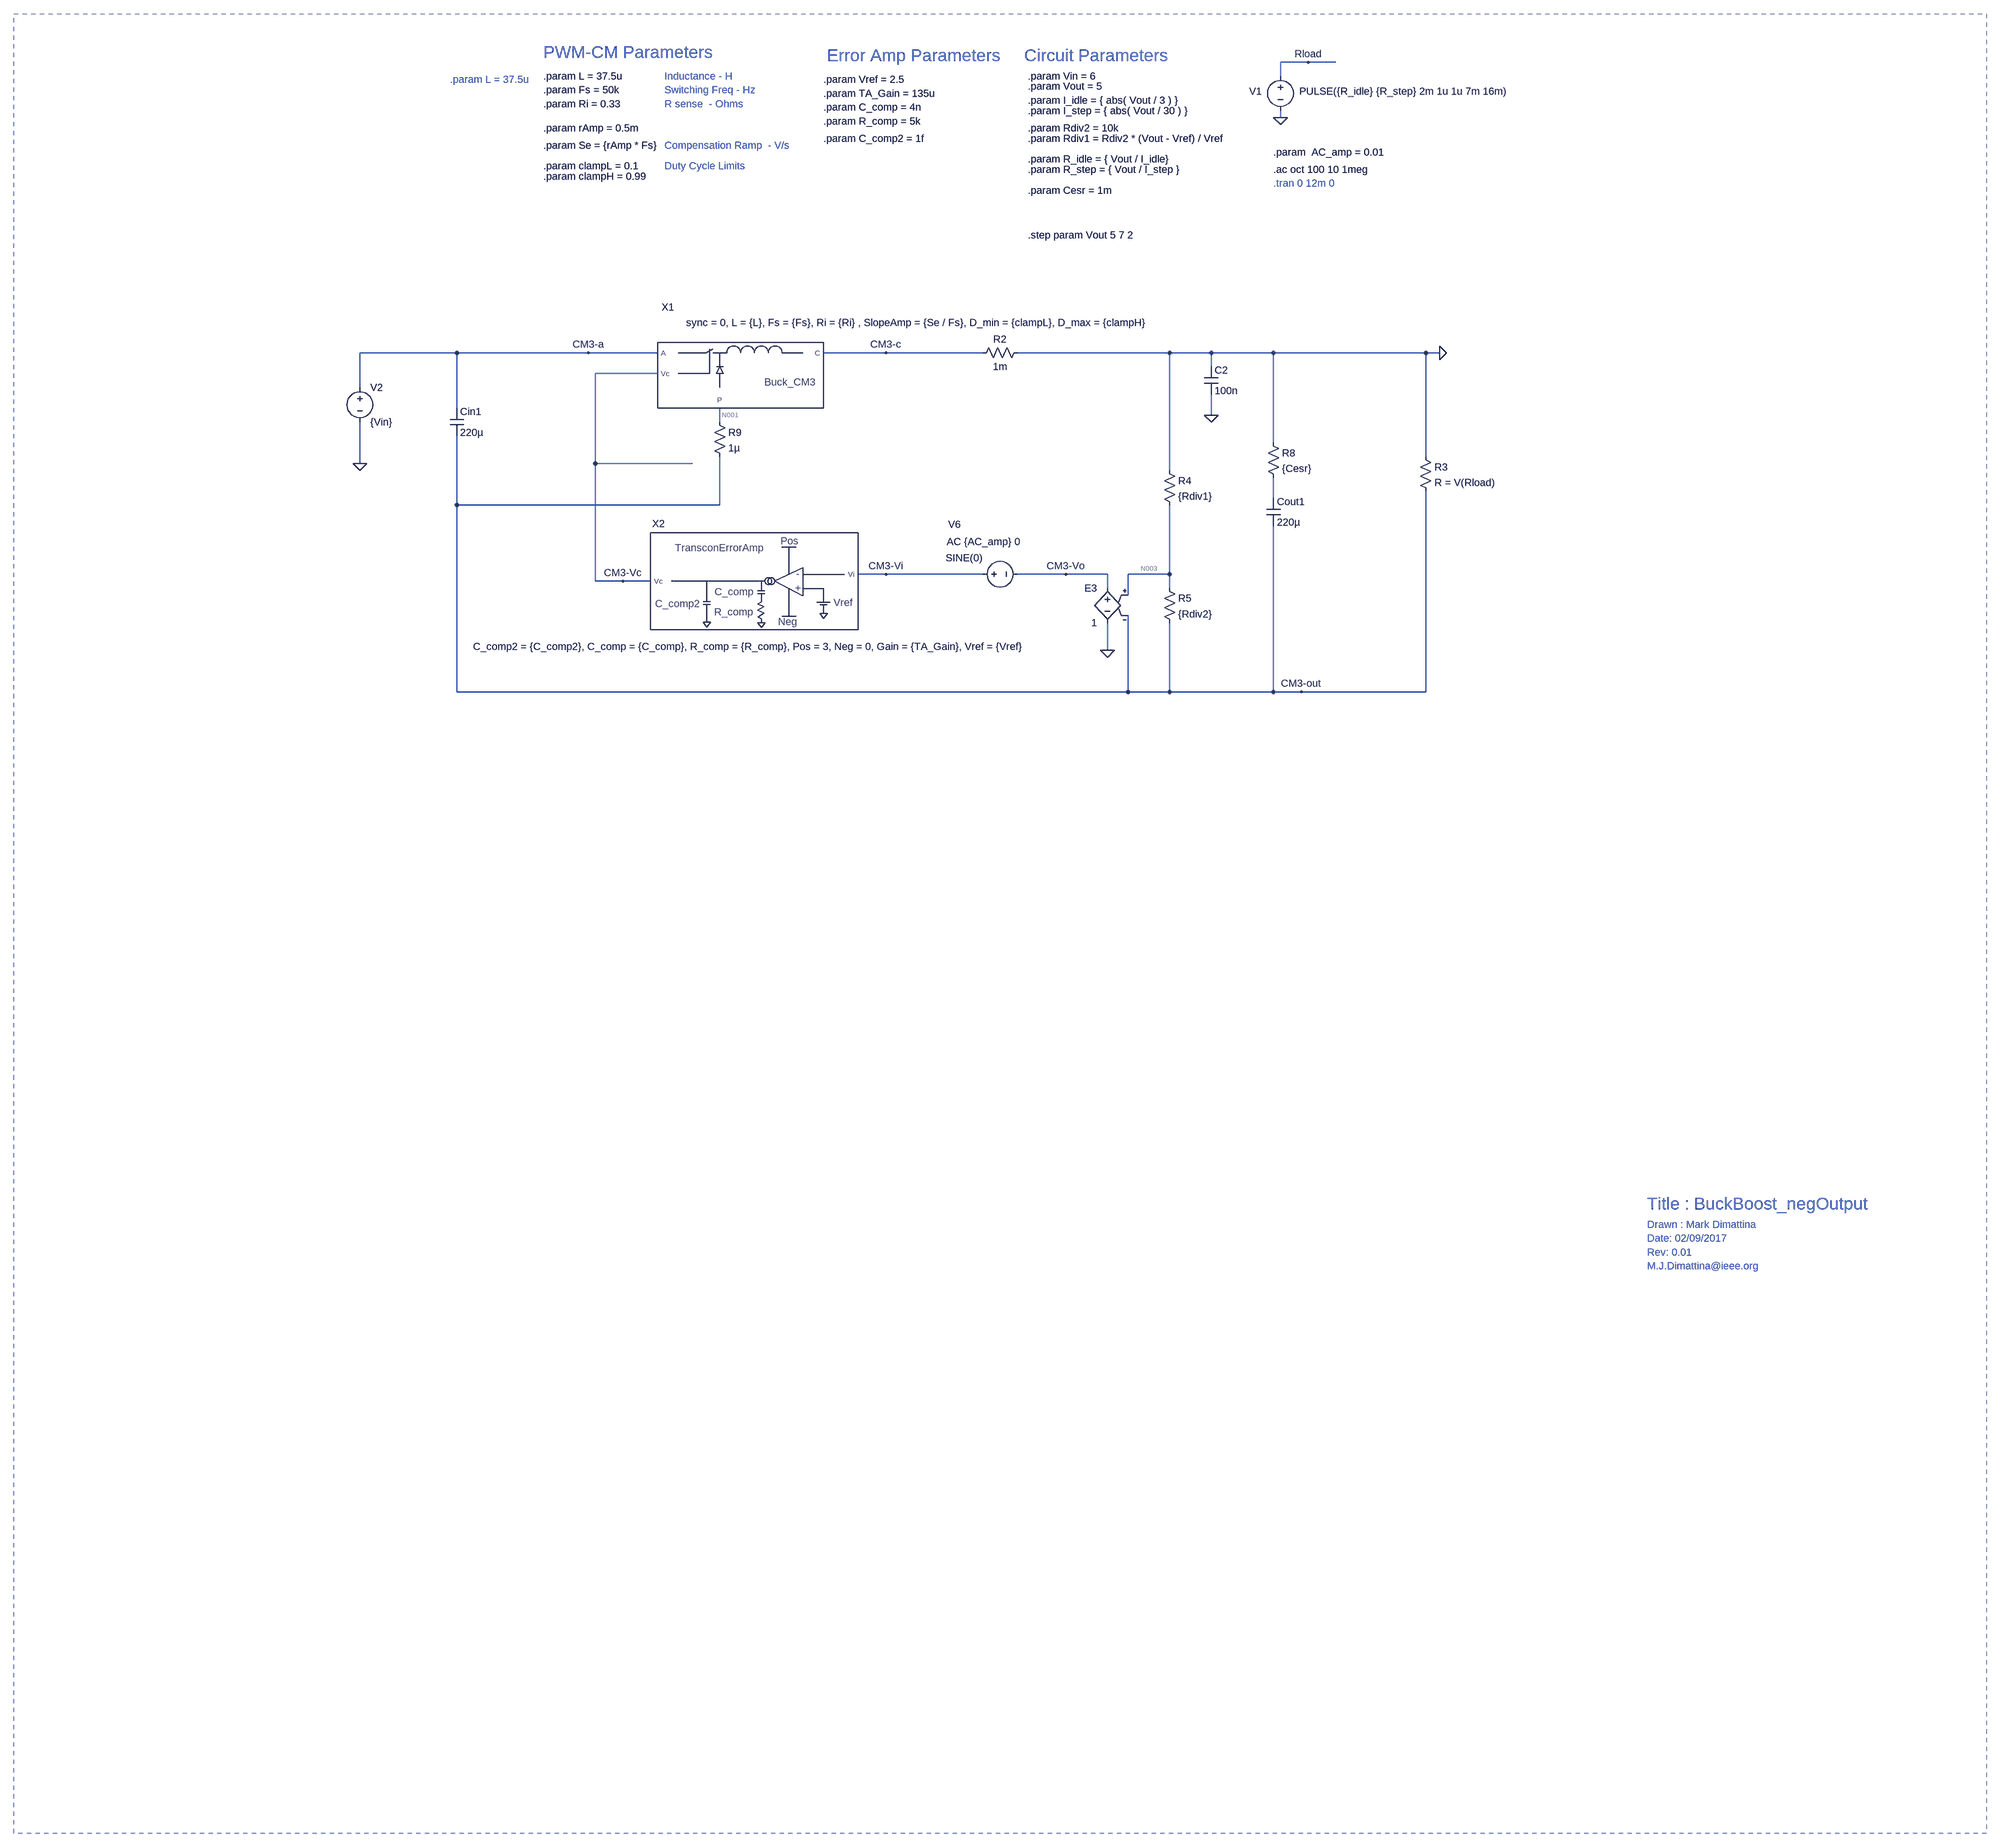
[diagram p0: schematic BuckBoost_negOutput_AC.asc]
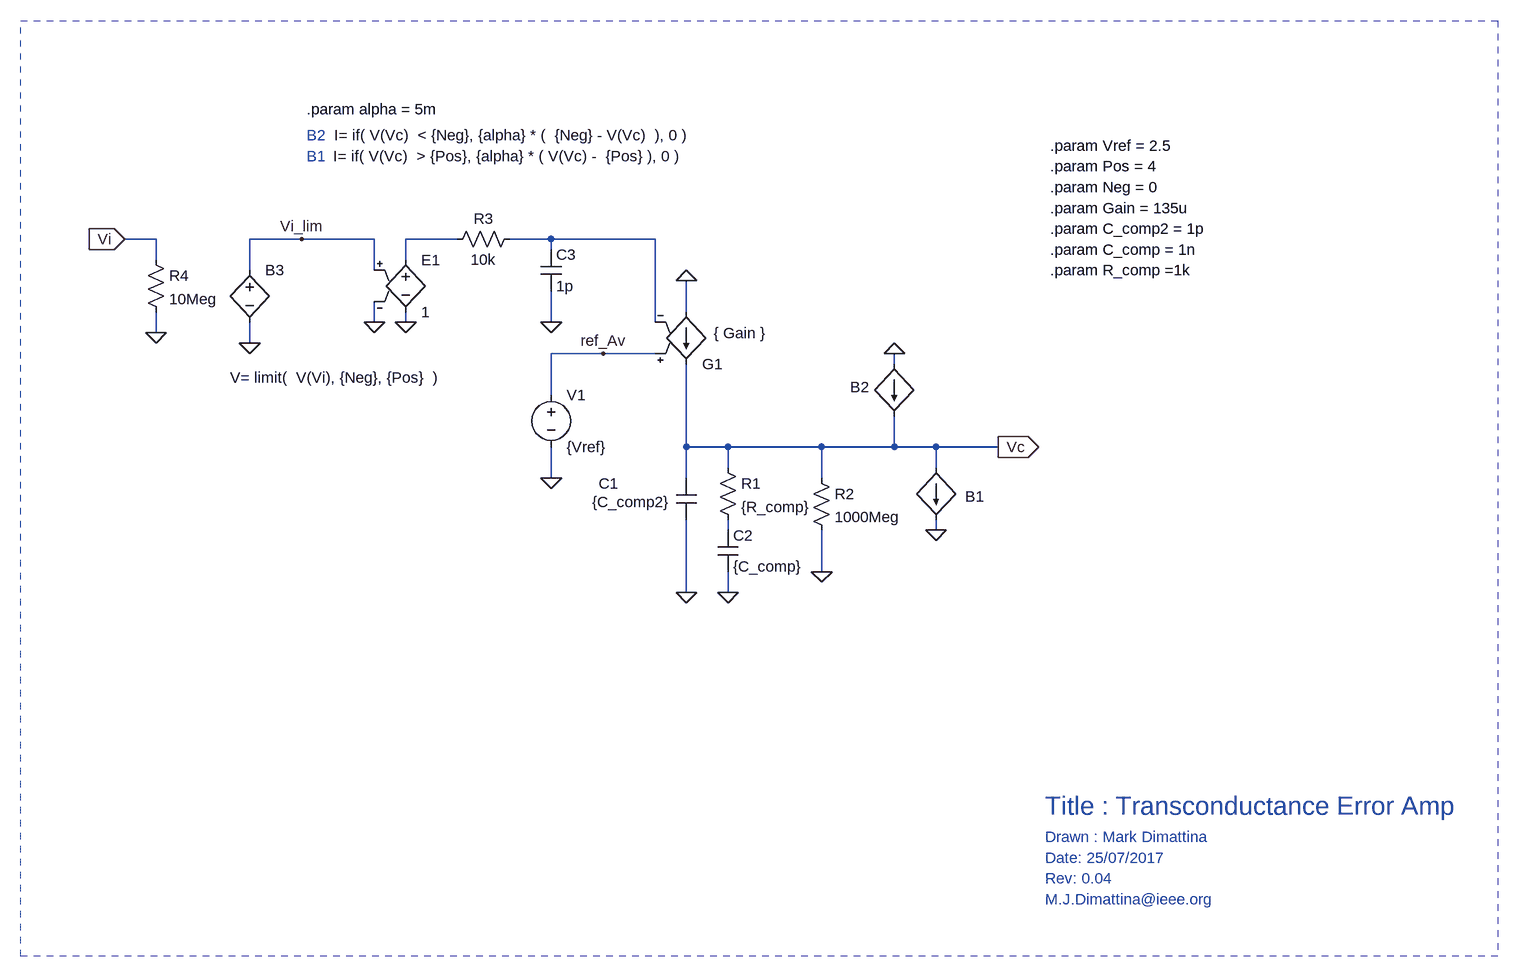
[diagram p1: sub-circuit transconerroramp.asc]
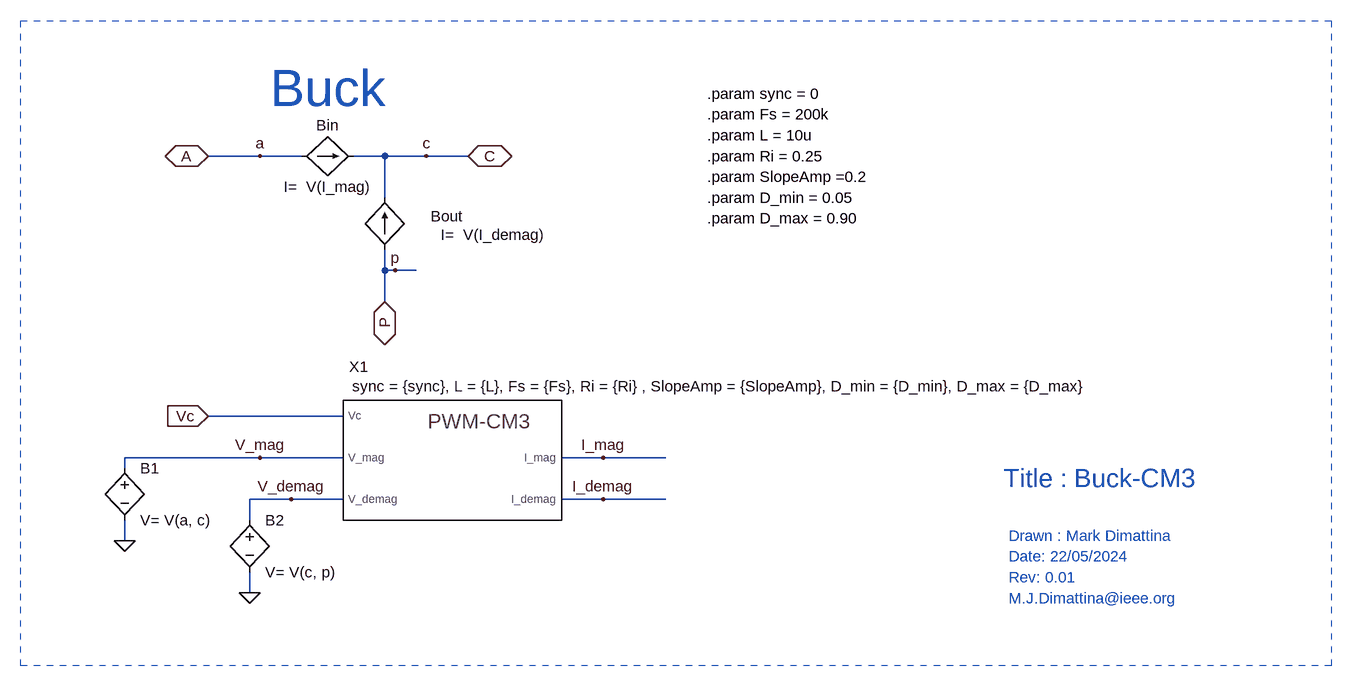
[diagram p2: sub-circuit buck_cm3.asc]
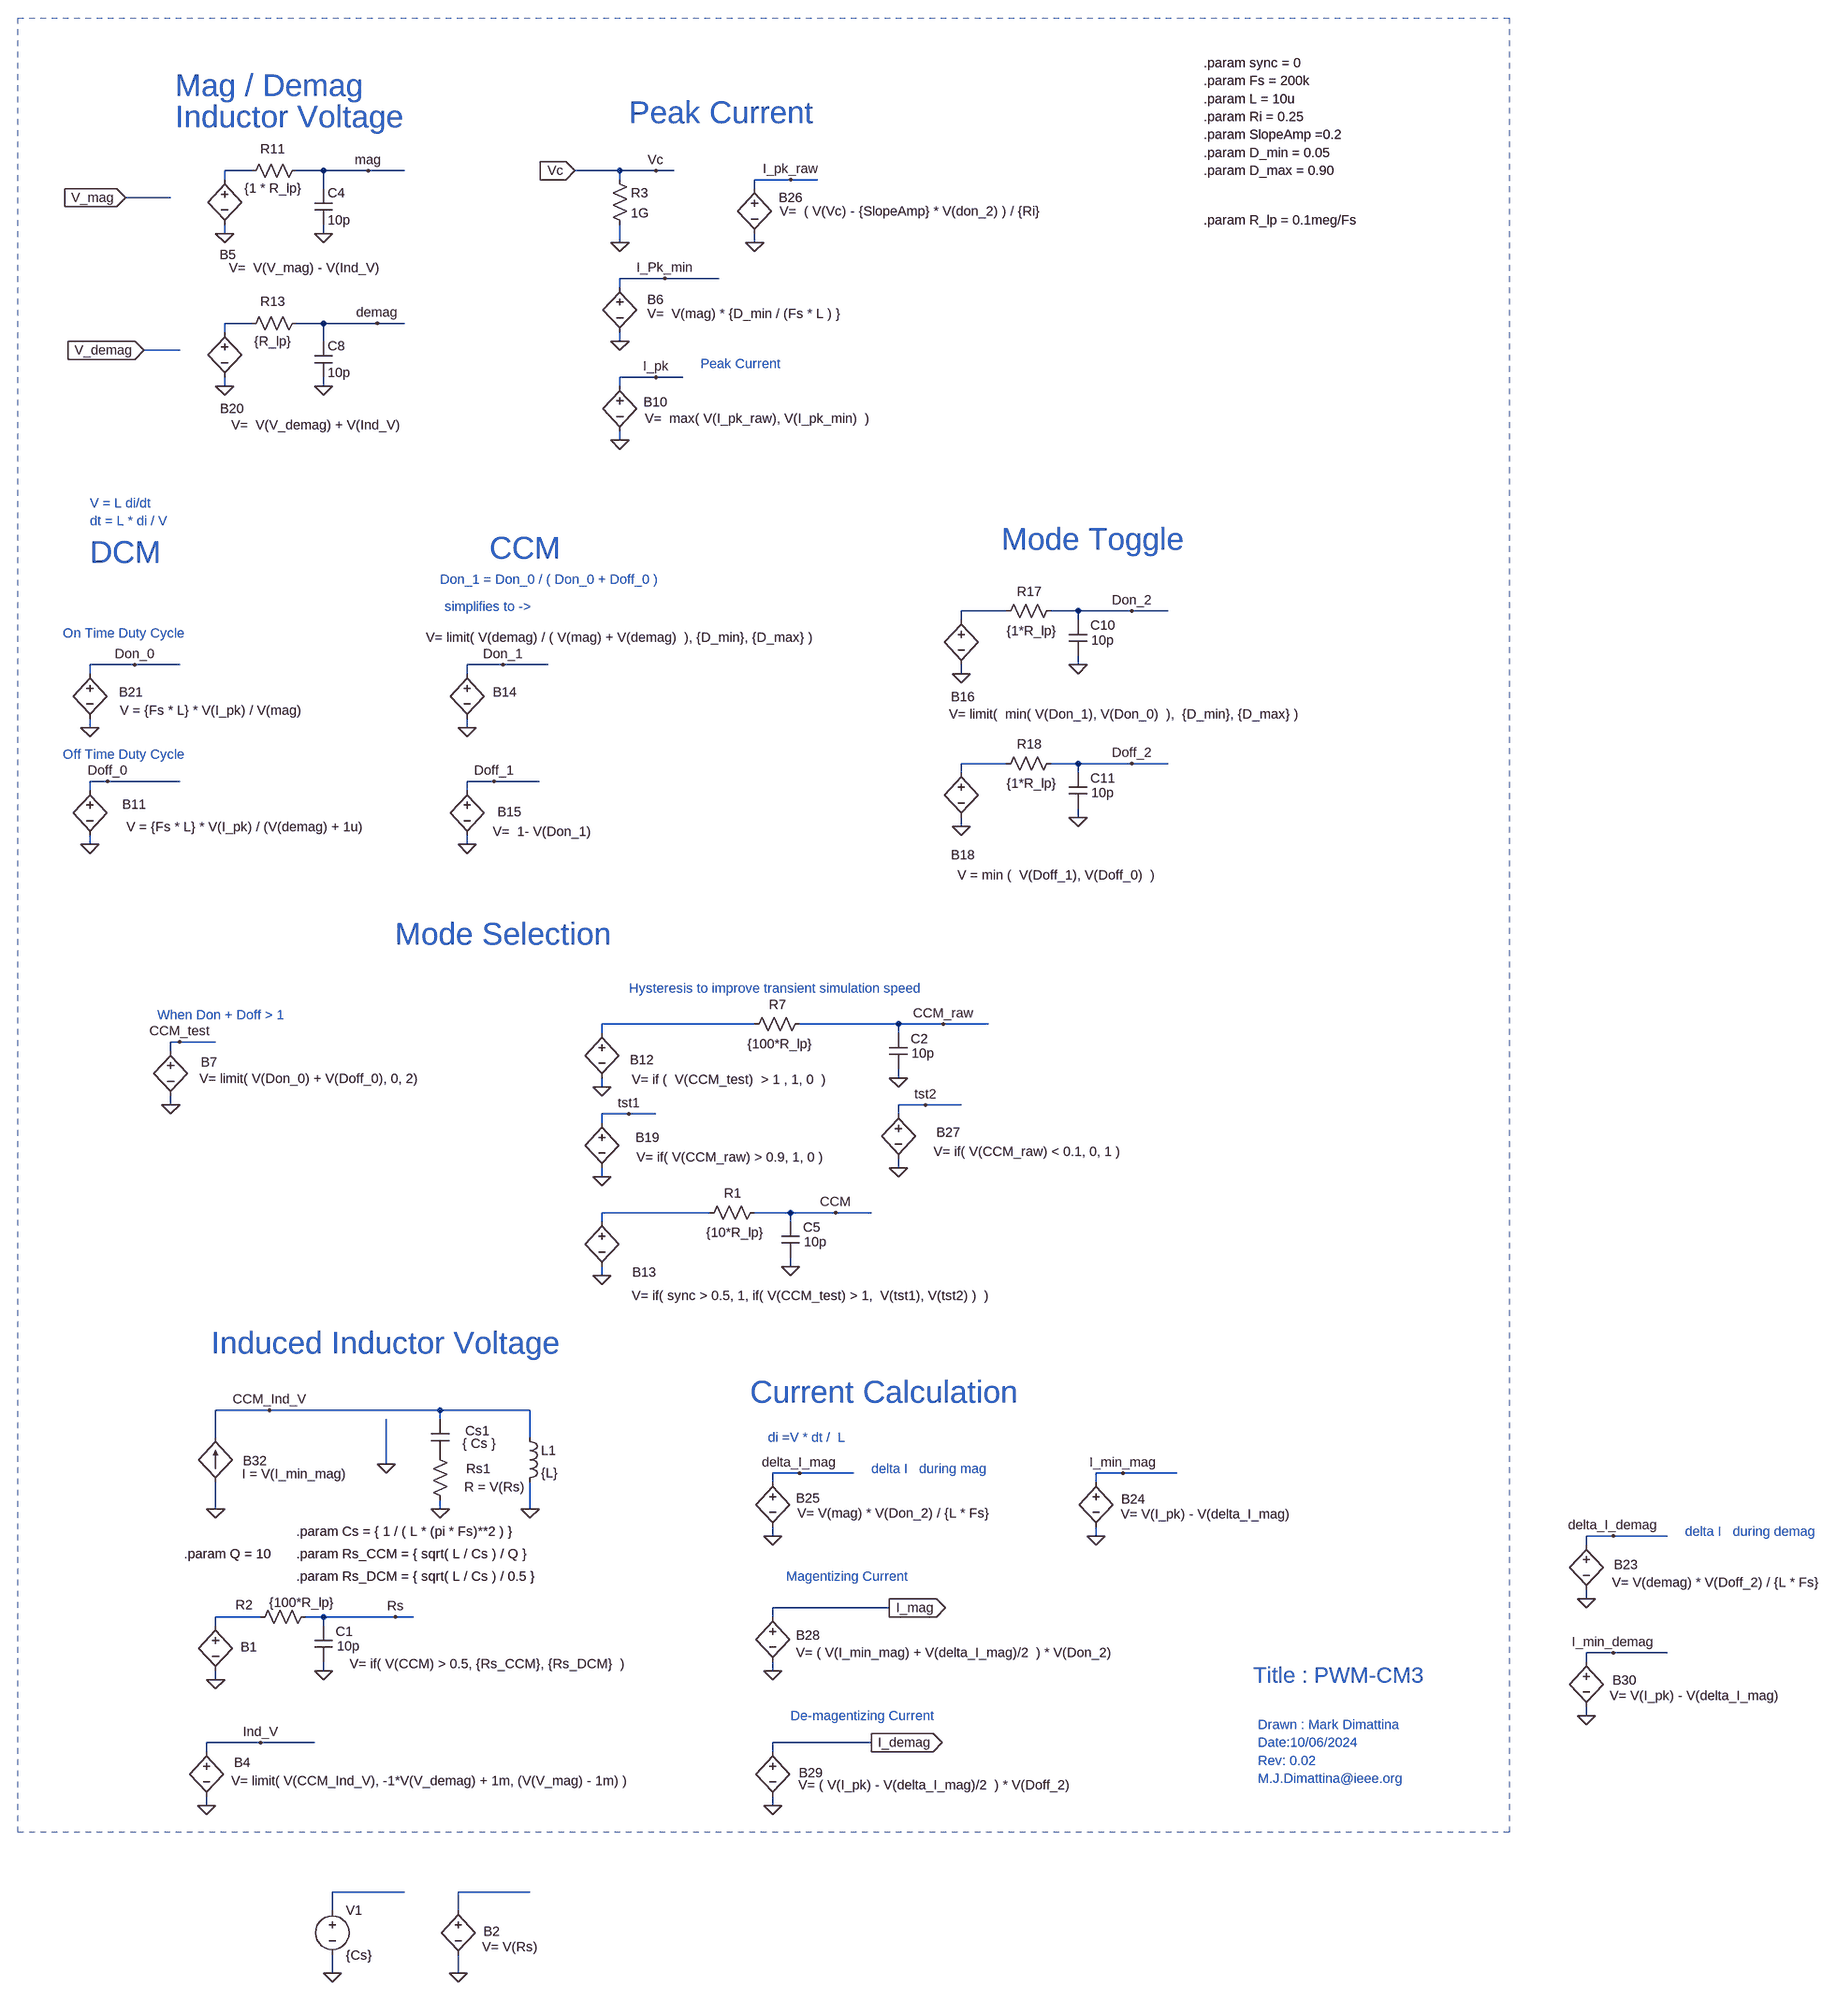
[diagram p3: sub-circuit pwm_cm3.asc]
BuckBoost_negOutput_AC.asc, the LTspice schematic file:
Version 4
SHEET 1 6372 4964
WIRE 2976 864 2912 864
WIRE 3040 864 2976 864
WIRE 2912 896 2912 864
WIRE 2912 992 2912 976
WIRE 1008 1536 784 1536
WIRE 1312 1536 1008 1536
WIRE 1472 1536 1312 1536
WIRE 2000 1536 1856 1536
WIRE 2224 1536 2000 1536
WIRE 2656 1536 2304 1536
WIRE 2752 1536 2656 1536
WIRE 2896 1536 2752 1536
WIRE 3248 1536 2896 1536
WIRE 3280 1536 3248 1536
WIRE 2752 1568 2752 1536
WIRE 1472 1584 1328 1584
WIRE 784 1616 784 1536
WIRE 1008 1664 1008 1536
WIRE 2752 1680 2752 1632
WIRE 1616 1696 1616 1664
WIRE 2896 1744 2896 1536
WIRE 3248 1776 3248 1536
WIRE 784 1792 784 1696
WIRE 1328 1792 1328 1584
WIRE 1552 1792 1328 1792
WIRE 2656 1808 2656 1536
WIRE 2896 1872 2896 1824
WIRE 1008 1888 1008 1728
WIRE 1616 1888 1616 1776
WIRE 1616 1888 1008 1888
WIRE 2000 2048 1936 2048
WIRE 2224 2048 2000 2048
WIRE 2416 2048 2304 2048
WIRE 2512 2048 2416 2048
WIRE 2656 2048 2656 1888
WIRE 2656 2048 2560 2048
WIRE 1328 2064 1328 1792
WIRE 1392 2064 1328 2064
WIRE 1456 2064 1392 2064
WIRE 2512 2080 2512 2048
WIRE 2656 2080 2656 2048
WIRE 2560 2096 2560 2048
WIRE 2512 2224 2512 2160
WIRE 1008 2320 1008 1888
WIRE 2560 2320 2560 2144
WIRE 2560 2320 1008 2320
WIRE 2656 2320 2656 2160
WIRE 2656 2320 2560 2320
WIRE 2896 2320 2896 1936
WIRE 2896 2320 2656 2320
WIRE 2960 2320 2896 2320
WIRE 3248 2320 3248 1856
WIRE 3248 2320 2960 2320
FLAG 2912 992 0
FLAG 2976 864 Rload
FLAG 1312 1536 CM3-a
FLAG 2960 2320 CM3-out
FLAG 784 1792 0
FLAG 1392 2064 CM3-Vc
FLAG 2000 2048 CM3-Vi
FLAG 2752 1680 0
FLAG 2000 1536 CM3-c
FLAG 2512 2224 0
FLAG 3280 1536 0
FLAG 2416 2048 CM3-Vo
DATAFLAG 1472 1792 ""
DATAFLAG 3120 2320 ""
SYMBOL voltage 2912 880 R0
WINDOW 123 0 0 Left 2
WINDOW 39 0 0 Left 2
WINDOW 0 -72 51 Left 2
WINDOW 3 44 51 Left 2
SYMATTR InstName V1
SYMATTR Value PULSE({R_idle} {R_step} 2m 1u 1u 7m 16m)
SYMBOL res 2320 1520 R90
WINDOW 0 0 56 VBottom 2
WINDOW 3 32 56 VTop 2
SYMATTR InstName R2
SYMATTR Value 1m
SYMBOL cap 2880 1872 R0
SYMATTR InstName Cout1
SYMATTR Value 220µ
SYMBOL res 3232 1760 R0
SYMATTR InstName R3
SYMATTR Value R = V(Rload)
SYMBOL res 2640 1792 R0
SYMATTR InstName R4
SYMATTR Value {Rdiv1}
SYMBOL res 2640 2064 R0
SYMATTR InstName R5
SYMATTR Value {Rdiv2}
SYMBOL voltage 784 1600 R0
SYMATTR InstName V2
SYMATTR Value {Vin}
SYMBOL res 2880 1728 R0
SYMATTR InstName R8
SYMATTR Value {Cesr}
SYMBOL res 1600 1680 R0
SYMATTR InstName R9
SYMATTR Value 1µ
SYMBOL TransconErrorAmp 1840 1984 M0
WINDOW 0 380 -53 Right 2
WINDOW 39 794 231 Right 2
SYMATTR InstName X2
SYMATTR SpiceLine C_comp2 = {C_comp2}, C_comp = {C_comp}, R_comp = {R_comp}, Pos = 3, Neg = 0, Gain = {TA_Gain}, Vref = {Vref}
SYMBOL voltage 2208 2048 R270
WINDOW 0 115 -64 VRight 2
WINDOW 3 38 -70 VRight 2
WINDOW 123 75 -67 VRight 2
WINDOW 39 0 0 Left 2
SYMATTR InstName V6
SYMATTR Value SINE(0)
SYMATTR Value2 AC {AC_amp} 0
SYMBOL cap 2736 1568 R0
SYMATTR InstName C2
SYMATTR Value 100n
SYMBOL e 2512 2064 M0
SYMATTR InstName E3
SYMATTR Value 1
SYMBOL cap 992 1664 R0
SYMATTR InstName Cin1
SYMATTR Value 220µ
SYMBOL Buck_CM3 1552 1568 R0
WINDOW 0 -56 -122 Bottom 2
WINDOW 39 518 -86 Bottom 2
SYMATTR InstName X1
SYMATTR SpiceLine sync = 0, L = {L}, Fs = {Fs}, Ri = {Ri} , SlopeAmp = {Se / Fs}, D_min = {clampL}, D_max = {clampH}
TEXT 1208 1104 Left 2 !.param clampL = 0.1
TEXT 1208 1128 Left 2 !.param clampH = 0.99
TEXT 2896 1112 Left 2 !.ac oct 100 10 1meg
TEXT 1208 896 Left 2 !.param L = 37.5u
TEXT 1208 928 Left 2 !.param Fs = 50k
TEXT 1208 960 Left 2 !.param Ri = 0.33
TEXT 1208 1056 Left 2 !.param Se = {rAmp * Fs}
TEXT 1488 1056 Left 2 ;Compensation Ramp  - V/s
TEXT 1488 960 Left 2 ;R sense  - Ohms
TEXT 1488 928 Left 2 ;Switching Freq - Hz
TEXT 1488 896 Left 2 ;Inductance - H
TEXT 1488 1104 Left 2 ;Duty Cycle Limits
TEXT 1208 840 Left 4 ;PWM-CM Parameters
TEXT 1856 904 Left 2 !.param Vref = 2.5
TEXT 1856 936 Left 2 !.param TA_Gain = 135u
TEXT 1856 968 Left 2 !.param C_comp = 4n
TEXT 1856 1000 Left 2 !.param R_comp = 5k
TEXT 2328 952 Left 2 !.param I_idle = { abs( Vout / 3 ) }
TEXT 2328 976 Left 2 !.param I_step = { abs( Vout / 30 ) }
TEXT 2328 920 Left 2 !.param Vout = 5
TEXT 2328 1088 Left 2 !.param R_idle = { Vout / I_idle}
TEXT 2328 1112 Left 2 !.param R_step = { Vout / I_step }
TEXT 2328 896 Left 2 !.param Vin = 6
TEXT 2328 1016 Left 2 !.param Rdiv2 = 10k
TEXT 2328 1040 Left 2 !.param Rdiv1 = Rdiv2 * (Vout - Vref) / Vref
TEXT 1208 1016 Left 2 !.param rAmp = 0.5m
TEXT 1864 848 Left 4 ;Error Amp Parameters
TEXT 2320 848 Left 4 ;Circuit Parameters
TEXT 3760 3552 Left 2 ;Drawn : Mark Dimattina
TEXT 3760 3504 Left 4 ;Title : BuckBoost_negOutput
TEXT 3760 3616 Left 2 ;Rev: 0.01
TEXT 3760 3584 Left 2 ;Date: 02/09/2017
TEXT 3760 3648 Left 2 ;M.J.Dimattina@ieee.org
TEXT 2328 1264 Left 2 !.step param Vout 5 7 2
TEXT 2896 1072 Left 2 !.param  AC_amp = 0.01
TEXT 992 904 Left 2 ;.param L = 37.5u
TEXT 2896 1144 Left 2 ;.tran 0 12m 0
TEXT 2328 1160 Left 2 !.param Cesr = 1m
TEXT 1856 1040 Left 2 !.param C_comp2 = 1f
RECTANGLE Normal 4544 4960 -16 752 2

transconerroramp.asc, the sub-circuit schematic file:
Version 4
SHEET 1 1752 1300
WIRE -560 192 -608 192
WIRE -336 192 -416 192
WIRE -224 192 -336 192
WIRE -96 192 -176 192
WIRE 48 192 -16 192
WIRE 208 192 48 192
WIRE 48 208 48 192
WIRE -560 224 -560 192
WIRE -176 224 -176 192
WIRE -416 240 -416 192
WIRE -224 240 -224 192
WIRE 256 304 256 256
WIRE -224 320 -224 288
WIRE -176 320 -176 304
WIRE 48 320 48 272
WIRE 208 320 208 192
WIRE -560 336 -560 304
WIRE -416 352 -416 320
WIRE 128 368 48 368
WIRE 208 368 128 368
WIRE 576 384 576 368
WIRE 48 432 48 368
WIRE 256 512 256 384
WIRE 320 512 256 512
WIRE 464 512 320 512
WIRE 576 512 576 464
WIRE 576 512 464 512
WIRE 640 512 576 512
WIRE 736 512 640 512
WIRE 320 544 320 512
WIRE 640 544 640 512
WIRE 48 560 48 512
WIRE 256 560 256 512
WIRE 464 560 464 512
WIRE 320 640 320 624
WIRE 640 640 640 624
WIRE 464 704 464 640
WIRE 256 736 256 624
WIRE 320 736 320 704
FLAG 48 560 0
FLAG 256 256 0
FLAG 256 736 0
FLAG 320 736 0
FLAG 128 368 ref_Av
FLAG -608 192 Vi
IOPIN -608 192 In
FLAG 736 512 Vc
IOPIN 736 512 Out
FLAG 640 640 0
FLAG 576 368 0
FLAG 464 704 0
FLAG -176 320 0
FLAG -224 320 0
FLAG 48 320 0
FLAG -416 352 0
FLAG -336 192 Vi_lim
FLAG -560 336 0
SYMBOL g 256 400 M180
WINDOW 3 42 63 Left 2
SYMATTR Value { Gain }
SYMATTR InstName G1
SYMBOL voltage 48 416 R0
SYMATTR InstName V1
SYMATTR Value {Vref}
SYMBOL cap 240 560 R0
WINDOW 3 -129 37 Left 2
WINDOW 0 -119 8 Left 2
SYMATTR Value {C_comp2}
SYMATTR InstName C1
SYMBOL cap 304 640 R0
SYMATTR InstName C2
SYMATTR Value {C_comp}
SYMBOL res 304 528 R0
SYMATTR InstName R1
SYMATTR Value {R_comp}
SYMBOL bi 640 544 R0
WINDOW 3 -927 -480 Left 2
WINDOW 0 45 44 Left 2
SYMATTR Value I= if( V(Vc)  > {Pos}, {alpha} * ( V(Vc) -  {Pos} ), 0 )
SYMATTR InstName B1
SYMBOL bi 576 384 R0
WINDOW 0 -68 36 Left 2
WINDOW 3 -862 -352 Left 2
SYMATTR InstName B2
SYMATTR Value I= if( V(Vc)  < {Neg}, {alpha} * (  {Neg} - V(Vc)  ), 0 )
SYMBOL res 448 544 R0
SYMATTR InstName R2
SYMATTR Value 1000Meg
SYMBOL cap 32 208 R0
SYMATTR InstName C3
SYMATTR Value 1p
SYMBOL res 0 176 R90
WINDOW 0 0 56 VBottom 2
WINDOW 3 32 56 VTop 2
SYMATTR InstName R3
SYMATTR Value 10k
SYMBOL e -176 208 R0
SYMATTR InstName E1
SYMATTR Value 1
SYMBOL bv -416 224 R0
WINDOW 3 -30 181 Left 2
SYMATTR Value V= limit(  V(Vi), {Neg}, {Pos}  )
SYMATTR InstName B3
SYMBOL res -576 208 R0
SYMATTR InstName R4
SYMATTR Value 10Meg
TEXT -328 -8 Left 2 !.param alpha = 5m
TEXT 816 240 Left 2 !.param R_comp =1k
TEXT 816 208 Left 2 !.param C_comp = 1n
TEXT 816 176 Left 2 !.param C_comp2 = 1p
TEXT -328 64 Left 2 ;B1
TEXT -328 32 Left 2 ;B2
TEXT 808 1112 Left 2 ;Drawn : Mark Dimattina
TEXT 808 1064 Left 4 ;Title : Transconductance Error Amp
TEXT 808 1176 Left 2 ;Rev: 0.04
TEXT 808 1144 Left 2 ;Date: 25/07/2017
TEXT 808 1208 Left 2 ;M.J.Dimattina@ieee.org
TEXT 816 80 Left 2 !.param Pos = 4
TEXT 816 112 Left 2 !.param Neg = 0
TEXT 816 48 Left 2 !.param Vref = 2.5
TEXT 816 144 Left 2 !.param Gain = 135u
RECTANGLE Normal 1504 1296 -768 -144 2

buck_cm3.asc, the sub-circuit schematic file:
Version 4
SHEET 1 3748 852
WIRE -1872 -2512 -1952 -2512
WIRE -1808 -2512 -1872 -2512
WIRE -1680 -2512 -1728 -2512
WIRE -1616 -2512 -1680 -2512
WIRE -1552 -2512 -1616 -2512
WIRE -1680 -2448 -1680 -2512
WIRE -1680 -2336 -1680 -2368
WIRE -1664 -2336 -1680 -2336
WIRE -1632 -2336 -1664 -2336
WIRE -1680 -2288 -1680 -2336
WIRE -1744 -2112 -1952 -2112
WIRE -1872 -2048 -2080 -2048
WIRE -1744 -2048 -1872 -2048
WIRE -1344 -2048 -1408 -2048
WIRE -1248 -2048 -1344 -2048
WIRE -2080 -2032 -2080 -2048
WIRE -1824 -1984 -1888 -1984
WIRE -1744 -1984 -1824 -1984
WIRE -1344 -1984 -1408 -1984
WIRE -1248 -1984 -1344 -1984
WIRE -1888 -1952 -1888 -1984
WIRE -2080 -1920 -2080 -1952
WIRE -1888 -1840 -1888 -1872
FLAG -1952 -2512 A
IOPIN -1952 -2512 BiDir
FLAG -1664 -2336 p
FLAG -1552 -2512 C
IOPIN -1552 -2512 BiDir
FLAG -1680 -2288 P
IOPIN -1680 -2288 BiDir
FLAG -1616 -2512 c
FLAG -1872 -2512 a
FLAG -1952 -2112 Vc
IOPIN -1952 -2112 In
FLAG -2080 -1920 0
FLAG -1888 -1840 0
FLAG -1344 -2048 I_mag
FLAG -1344 -1984 I_demag
FLAG -1872 -2048 V_mag
FLAG -1824 -1984 V_demag
SYMBOL bi -1808 -2512 R270
WINDOW 0 32 40 VTop 2
WINDOW 3 -32 40 VBottom 2
SYMATTR InstName Bin
SYMATTR Value I=  V(I_mag)
SYMBOL bi -1680 -2368 R180
WINDOW 0 -120 51 Left 2
WINDOW 3 -247 23 Left 2
SYMATTR InstName Bout
SYMATTR Value I=  V(I_demag)
SYMBOL PWM_CM3 -1584 -2048 R0
WINDOW 0 -136 -124 Bottom 2
WINDOW 39 -146 -110 Left 2
SYMATTR InstName X1
SYMATTR SpiceLine sync = {sync}, L = {L}, Fs = {Fs}, Ri = {Ri} , SlopeAmp = {SlopeAmp}, D_min = {D_min}, D_max = {D_max}
SYMBOL bv -2080 -2048 R0
SYMATTR InstName B1
SYMATTR Value V= V(a, c)
SYMBOL bv -1888 -1968 R0
SYMATTR InstName B2
SYMATTR Value V= V(c, p)
TEXT -1184 -2544 Left 2 !.param L = 10u
TEXT -1184 -2576 Left 2 !.param Fs = 200k
TEXT -1184 -2448 Left 2 !.param D_min = 0.05
TEXT -1184 -2416 Left 2 !.param D_max = 0.90
TEXT -1184 -2480 Left 2 !.param SlopeAmp =0.2
TEXT -1184 -2512 Left 2 !.param Ri = 0.25
TEXT -1184 -2608 Left 2 !.param sync = 0
TEXT -720 -1928 Left 2 ;Drawn : Mark Dimattina
TEXT -728 -2016 Left 4 ;Title : Buck-CM3
TEXT -720 -1864 Left 2 ;Rev: 0.01
TEXT -720 -1896 Left 2 ;Date: 22/05/2024
TEXT -720 -1832 Left 2 ;M.J.Dimattina@ieee.org
TEXT -1856 -2616 Left 6 ;Buck
RECTANGLE Normal -224 -1728 -2240 -2720 2

pwm_cm3.asc, the sub-circuit schematic file:
Version 4
SHEET 1 4220 852
WIRE -1600 -4432 -1648 -4432
WIRE -1472 -4432 -1520 -4432
WIRE -1392 -4432 -1472 -4432
WIRE -1328 -4432 -1392 -4432
WIRE -944 -4432 -1024 -4432
WIRE -880 -4432 -944 -4432
WIRE -848 -4432 -880 -4432
WIRE -1648 -4416 -1648 -4432
WIRE -944 -4416 -944 -4432
WIRE -640 -4416 -704 -4416
WIRE -592 -4416 -640 -4416
WIRE -1472 -4400 -1472 -4432
WIRE -704 -4400 -704 -4416
WIRE -1744 -4384 -1824 -4384
WIRE -1648 -4320 -1648 -4336
WIRE -1472 -4320 -1472 -4336
WIRE -944 -4304 -944 -4336
WIRE -704 -4304 -704 -4320
WIRE -864 -4240 -944 -4240
WIRE -768 -4240 -864 -4240
WIRE -944 -4224 -944 -4240
WIRE -1600 -4160 -1648 -4160
WIRE -1472 -4160 -1520 -4160
WIRE -1376 -4160 -1472 -4160
WIRE -1328 -4160 -1376 -4160
WIRE -1648 -4144 -1648 -4160
WIRE -1472 -4128 -1472 -4160
WIRE -944 -4128 -944 -4144
WIRE -1728 -4112 -1792 -4112
WIRE -880 -4064 -944 -4064
WIRE -832 -4064 -880 -4064
WIRE -1648 -4048 -1648 -4064
WIRE -1472 -4048 -1472 -4064
WIRE -944 -4048 -944 -4064
WIRE -944 -3952 -944 -3968
WIRE -256 -3648 -336 -3648
WIRE -128 -3648 -176 -3648
WIRE -32 -3648 -128 -3648
WIRE 32 -3648 -32 -3648
WIRE -336 -3632 -336 -3648
WIRE -128 -3632 -128 -3648
WIRE -1808 -3552 -1888 -3552
WIRE -1728 -3552 -1808 -3552
WIRE -1152 -3552 -1216 -3552
WIRE -1072 -3552 -1152 -3552
WIRE -128 -3552 -128 -3568
WIRE -1888 -3536 -1888 -3552
WIRE -1216 -3536 -1216 -3552
WIRE -336 -3536 -336 -3552
WIRE -1888 -3440 -1888 -3456
WIRE -1216 -3440 -1216 -3456
WIRE -256 -3376 -336 -3376
WIRE -128 -3376 -176 -3376
WIRE -32 -3376 -128 -3376
WIRE 32 -3376 -32 -3376
WIRE -336 -3360 -336 -3376
WIRE -128 -3360 -128 -3376
WIRE -1856 -3344 -1888 -3344
WIRE -1728 -3344 -1856 -3344
WIRE -1168 -3344 -1216 -3344
WIRE -1088 -3344 -1168 -3344
WIRE -1888 -3328 -1888 -3344
WIRE -1216 -3328 -1216 -3344
WIRE -128 -3280 -128 -3296
WIRE -336 -3264 -336 -3280
WIRE -1888 -3232 -1888 -3248
WIRE -1216 -3232 -1216 -3248
WIRE -704 -2912 -976 -2912
WIRE -448 -2912 -624 -2912
WIRE -368 -2912 -448 -2912
WIRE -288 -2912 -368 -2912
WIRE -976 -2896 -976 -2912
WIRE -448 -2896 -448 -2912
WIRE -1728 -2880 -1744 -2880
WIRE -1664 -2880 -1728 -2880
WIRE -1744 -2864 -1744 -2880
WIRE -448 -2816 -448 -2832
WIRE -976 -2800 -976 -2816
WIRE -1744 -2768 -1744 -2784
WIRE -400 -2768 -448 -2768
WIRE -336 -2768 -400 -2768
WIRE -928 -2752 -976 -2752
WIRE -880 -2752 -928 -2752
WIRE -448 -2752 -448 -2768
WIRE -976 -2736 -976 -2752
WIRE -448 -2656 -448 -2672
WIRE -976 -2640 -976 -2656
WIRE -784 -2576 -976 -2576
WIRE -640 -2576 -704 -2576
WIRE -560 -2576 -640 -2576
WIRE -496 -2576 -560 -2576
WIRE -976 -2560 -976 -2576
WIRE -640 -2560 -640 -2576
WIRE -640 -2480 -640 -2496
WIRE -976 -2464 -976 -2480
WIRE -1568 -2224 -1664 -2224
WIRE -1264 -2224 -1568 -2224
WIRE -1104 -2224 -1264 -2224
WIRE -1264 -2208 -1264 -2224
WIRE -1664 -2176 -1664 -2224
WIRE -1104 -2176 -1104 -2224
WIRE -1360 -2128 -1360 -2208
WIRE -624 -2112 -672 -2112
WIRE -528 -2112 -624 -2112
WIRE -48 -2112 -96 -2112
WIRE 48 -2112 -48 -2112
WIRE -672 -2096 -672 -2112
WIRE -96 -2096 -96 -2112
WIRE -1664 -2048 -1664 -2096
WIRE -1264 -2048 -1264 -2064
WIRE -1104 -2048 -1104 -2096
WIRE -672 -2000 -672 -2016
WIRE -96 -2000 -96 -2016
WIRE 832 -2000 784 -2000
WIRE 928 -2000 832 -2000
WIRE 784 -1984 784 -2000
WIRE 784 -1888 784 -1904
WIRE -464 -1872 -672 -1872
WIRE -1584 -1856 -1664 -1856
WIRE -1472 -1856 -1504 -1856
WIRE -1344 -1856 -1472 -1856
WIRE -1312 -1856 -1344 -1856
WIRE -672 -1856 -672 -1872
WIRE -1664 -1840 -1664 -1856
WIRE -1472 -1840 -1472 -1856
WIRE 832 -1792 784 -1792
WIRE 928 -1792 832 -1792
WIRE 784 -1776 784 -1792
WIRE -1472 -1760 -1472 -1776
WIRE -672 -1760 -672 -1776
WIRE -1664 -1744 -1664 -1760
WIRE 784 -1680 784 -1696
WIRE -1584 -1632 -1680 -1632
WIRE -1488 -1632 -1584 -1632
WIRE -496 -1632 -672 -1632
WIRE -1680 -1616 -1680 -1632
WIRE -672 -1616 -672 -1632
WIRE -1680 -1520 -1680 -1536
WIRE -672 -1520 -672 -1536
WIRE -1328 -1312 -1456 -1312
WIRE -1104 -1312 -1232 -1312
WIRE -1456 -1280 -1456 -1312
WIRE -1232 -1280 -1232 -1312
WIRE -1456 -1168 -1456 -1200
WIRE -1232 -1168 -1232 -1200
FLAG -944 -4304 0
FLAG -1024 -4432 Vc
IOPIN -1024 -4432 In
FLAG -880 -4432 Vc
FLAG -880 -4064 I_pk
FLAG -944 -4128 0
FLAG -864 -4240 I_Pk_min
FLAG -944 -3952 0
FLAG -704 -4304 0
FLAG -640 -4416 I_pk_raw
FLAG -1888 -3440 0
FLAG -1808 -3552 Don_0
FLAG -1888 -3232 0
FLAG -976 -2800 0
FLAG -560 -2576 CCM
FLAG -448 -2816 0
FLAG -1216 -3440 0
FLAG -1216 -3232 0
FLAG -1168 -3344 Doff_1
FLAG -336 -3536 0
FLAG -32 -3648 Don_2
FLAG -128 -3552 0
FLAG -336 -3264 0
FLAG -32 -3376 Doff_2
FLAG -128 -3280 0
FLAG 784 -1888 0
FLAG 832 -2000 delta_I_demag
FLAG -96 -2000 0
FLAG -48 -2112 I_min_mag
FLAG -672 -2000 0
FLAG -624 -2112 delta_I_mag
FLAG -672 -1760 0
FLAG -464 -1872 I_mag
IOPIN -464 -1872 Out
FLAG -672 -1520 0
FLAG -496 -1632 I_demag
IOPIN -496 -1632 Out
FLAG 784 -1680 0
FLAG 832 -1792 I_min_demag
FLAG -1856 -3344 Doff_0
FLAG -1568 -2224 CCM_Ind_V
FLAG -1648 -4320 0
FLAG -1392 -4432 mag
FLAG -1472 -4320 0
FLAG -1456 -1168 0
FLAG -368 -2912 CCM_raw
FLAG -1152 -3552 Don_1
FLAG -1680 -1520 0
FLAG -1584 -1632 Ind_V
FLAG -1648 -4048 0
FLAG -1376 -4160 demag
FLAG -1472 -4048 0
FLAG -1744 -2768 0
FLAG -1728 -2880 CCM_test
FLAG -976 -2464 0
FLAG -928 -2752 tst1
FLAG -976 -2640 0
FLAG -400 -2768 tst2
FLAG -448 -2656 0
FLAG -640 -2480 0
FLAG -1664 -2048 0
FLAG -1264 -2048 0
FLAG -1104 -2048 0
FLAG -1824 -4384 V_mag
IOPIN -1824 -4384 In
FLAG -1792 -4112 V_demag
IOPIN -1792 -4112 In
FLAG -1232 -1168 0
FLAG -1360 -2128 0
FLAG -1664 -1744 0
FLAG -1344 -1856 Rs
FLAG -1472 -1760 0
DATAFLAG -1376 -1312 ""
DATAFLAG -1152 -1312 ""
SYMBOL res -960 -4432 R0
SYMATTR InstName R3
SYMATTR Value 1G
SYMBOL bv -944 -4240 R0
WINDOW 3 49 63 Left 2
WINDOW 0 49 38 Left 2
SYMATTR Value V=  V(mag) * {D_min / (Fs * L ) }
SYMATTR InstName B6
SYMBOL bv -944 -4064 R0
WINDOW 3 45 73 Left 2
WINDOW 0 42 44 Left 2
SYMATTR Value V=  max( V(I_pk_raw), V(I_pk_min)  )
SYMATTR InstName B10
SYMBOL bv -704 -4416 R0
WINDOW 3 45 56 Left 2
WINDOW 0 43 32 Left 2
SYMATTR Value V=  ( V(Vc) - {SlopeAmp} * V(don_2) ) / {Ri}
SYMATTR InstName B26
SYMBOL bv -1888 -3552 R0
WINDOW 3 54 81 Left 2
WINDOW 0 52 49 Left 2
SYMATTR Value V = {Fs * L} * V(I_pk) / V(mag)
SYMATTR InstName B21
SYMBOL bv -1888 -3344 R0
WINDOW 3 65 81 Left 2
WINDOW 0 58 41 Left 2
SYMATTR Value V = {Fs * L} * V(I_pk) / (V(demag) + 1u)
SYMATTR InstName B11
SYMBOL bv -976 -2912 R0
WINDOW 3 53 99 Left 2
WINDOW 0 50 64 Left 2
SYMATTR Value V= if (  V(CCM_test)  > 1 , 1, 0  )
SYMATTR InstName B12
SYMBOL res -608 -2928 R90
WINDOW 0 -3 55 VBottom 2
WINDOW 3 36 51 VTop 2
SYMATTR InstName R7
SYMATTR Value {100*R_lp}
SYMBOL cap -464 -2896 R0
WINDOW 0 38 10 Left 2
WINDOW 3 40 36 Left 2
SYMATTR InstName C2
SYMATTR Value 10p
SYMBOL bv -1216 -3552 R0
WINDOW 3 -73 -49 Left 2
WINDOW 0 46 49 Left 2
SYMATTR Value V= limit( V(demag) / ( V(mag) + V(demag)  ), {D_min}, {D_max} )
SYMATTR InstName B14
SYMBOL bv -1216 -3344 R0
WINDOW 3 221 89 Right 2
WINDOW 0 54 54 Left 2
SYMATTR Value V=  1- V(Don_1)
SYMATTR InstName B15
SYMBOL bv -336 -3648 R0
WINDOW 3 -22 184 Left 2
WINDOW 0 -18 153 Left 2
SYMATTR Value V= limit(  min( V(Don_1), V(Don_0)  ),  {D_min}, {D_max} )
SYMATTR InstName B16
SYMBOL res -160 -3664 R90
WINDOW 0 -3 55 VBottom 2
WINDOW 3 36 51 VTop 2
SYMATTR InstName R17
SYMATTR Value {1*R_lp}
SYMBOL cap -144 -3632 R0
WINDOW 0 38 10 Left 2
WINDOW 3 40 36 Left 2
SYMATTR InstName C10
SYMATTR Value 10p
SYMBOL bv -336 -3376 R0
WINDOW 3 -7 199 Left 2
WINDOW 0 -18 163 Left 2
SYMATTR Value V = min (  V(Doff_1), V(Doff_0)  )
SYMATTR InstName B18
SYMBOL res -160 -3392 R90
WINDOW 0 -3 55 VBottom 2
WINDOW 3 36 51 VTop 2
SYMATTR InstName R18
SYMATTR Value {1*R_lp}
SYMBOL cap -144 -3360 R0
WINDOW 0 38 10 Left 2
WINDOW 3 40 36 Left 2
SYMATTR InstName C11
SYMATTR Value 10p
SYMBOL bv 784 -2000 R0
WINDOW 3 46 83 Left 2
WINDOW 0 49 51 Left 2
SYMATTR Value V= V(demag) * V(Doff_2) / {L * Fs}
SYMATTR InstName B23
SYMBOL bv -96 -2112 R0
WINDOW 3 44 73 Left 2
WINDOW 0 45 46 Left 2
SYMATTR Value V= V(I_pk) - V(delta_I_mag)
SYMATTR InstName B24
SYMBOL bv -672 -2112 R0
WINDOW 3 44 71 Left 2
WINDOW 0 42 45 Left 2
SYMATTR Value V= V(mag) * V(Don_2) / {L * Fs}
SYMATTR InstName B25
SYMBOL bv -672 -1872 R0
WINDOW 3 42 80 Left 2
WINDOW 0 42 49 Left 2
SYMATTR Value V= ( V(I_min_mag) + V(delta_I_mag)/2  ) * V(Don_2)
SYMATTR InstName B28
SYMBOL bv -672 -1632 R0
WINDOW 3 46 76 Left 2
WINDOW 0 47 54 Left 2
SYMATTR Value V= ( V(I_pk) - V(delta_I_mag)/2  ) * V(Doff_2)
SYMATTR InstName B29
SYMBOL bv 784 -1792 R0
WINDOW 3 42 76 Left 2
WINDOW 0 47 49 Left 2
SYMATTR Value V= V(I_pk) - V(delta_I_mag)
SYMATTR InstName B30
SYMBOL cap -1280 -2208 R0
WINDOW 0 61 21 Left 2
WINDOW 3 56 43 Left 2
SYMATTR InstName Cs1
SYMATTR Value { Cs }
SYMBOL ind -1120 -2192 R0
SYMATTR InstName L1
SYMATTR Value {L}
SYMATTR SpiceLine Rser=0.1u
SYMBOL bv -1648 -4432 R0
WINDOW 3 277 173 Right 2
WINDOW 0 -9 150 Left 2
SYMATTR Value V=  V(V_mag) - V(Ind_V)
SYMATTR InstName B5
SYMBOL res -1504 -4448 R90
WINDOW 0 -7 58 VBottom 2
WINDOW 3 32 58 VTop 2
SYMATTR InstName R11
SYMATTR Value {1 * R_lp}
SYMBOL cap -1488 -4400 R0
SYMATTR InstName C4
SYMATTR Value 10p
SYMBOL voltage -1456 -1296 R0
SYMATTR InstName V1
SYMATTR Value {Cs}
SYMBOL bv -1680 -1632 R0
WINDOW 0 49 36 Left 2
WINDOW 3 44 68 Left 2
SYMATTR InstName B4
SYMATTR Value V= limit( V(CCM_Ind_V), -1*V(V_demag) + 1m, (V(V_mag) - 1m) )
SYMBOL bv -1648 -4160 R0
WINDOW 3 314 181 Right 2
WINDOW 0 -8 152 Left 2
SYMATTR Value V=  V(V_demag) + V(Ind_V)
SYMATTR InstName B20
SYMBOL res -1504 -4176 R90
WINDOW 0 -7 58 VBottom 2
WINDOW 3 32 58 VTop 2
SYMATTR InstName R13
SYMATTR Value {R_lp}
SYMBOL cap -1488 -4128 R0
SYMATTR InstName C8
SYMATTR Value 10p
SYMBOL bv -1744 -2880 R0
WINDOW 3 51 65 Left 2
WINDOW 0 54 36 Left 2
SYMATTR Value V= limit( V(Don_0) + V(Doff_0), 0, 2)
SYMATTR InstName B7
SYMBOL bv -976 -2576 R0
WINDOW 3 53 148 Left 2
WINDOW 0 54 106 Left 2
SYMATTR Value V= if( sync > 0.5, 1, if( V(CCM_test) > 1,  V(tst1), V(tst2) )  )
SYMATTR InstName B13
SYMBOL bv -976 -2752 R0
WINDOW 3 62 77 Left 2
WINDOW 0 60 42 Left 2
SYMATTR Value V= if( V(CCM_raw) > 0.9, 1, 0 )
SYMATTR InstName B19
SYMBOL bv -448 -2768 R0
WINDOW 3 63 83 Left 2
WINDOW 0 68 49 Left 2
SYMATTR Value V= if( V(CCM_raw) < 0.1, 0, 1 )
SYMATTR InstName B27
SYMBOL res -688 -2592 R90
WINDOW 0 -3 55 VBottom 2
WINDOW 3 36 51 VTop 2
SYMATTR InstName R1
SYMATTR Value {10*R_lp}
SYMBOL cap -656 -2560 R0
WINDOW 0 38 10 Left 2
WINDOW 3 40 36 Left 2
SYMATTR InstName C5
SYMATTR Value 10p
SYMBOL bi -1664 -2096 R180
WINDOW 0 -92 38 Left 2
WINDOW 3 -47 15 Right 2
SYMATTR InstName B32
SYMATTR Value I = V(I_min_mag)
SYMBOL res -1280 -2160 R0
WINDOW 0 62 40 Left 2
WINDOW 3 59 73 Left 2
SYMATTR InstName Rs1
SYMATTR Value R = V(Rs)
SYMBOL bv -1664 -1856 R0
WINDOW 0 45 54 Left 2
WINDOW 3 239 84 Left 2
SYMATTR InstName B1
SYMATTR Value V= if( V(CCM) > 0.5, {Rs_CCM}, {Rs_DCM}  )
SYMBOL bv -1232 -1296 R0
WINDOW 0 45 54 Left 2
WINDOW 3 43 81 Left 2
SYMATTR InstName B2
SYMATTR Value V= V(Rs)
SYMBOL res -1488 -1872 R90
WINDOW 0 10 125 VBottom 2
WINDOW 3 -25 23 VTop 2
SYMATTR InstName R2
SYMATTR Value {100*R_lp}
SYMBOL cap -1488 -1840 R0
WINDOW 0 38 10 Left 2
WINDOW 3 40 36 Left 2
SYMATTR InstName C1
SYMATTR Value 10p
TEXT 96 -4344 Left 2 !.param R_lp = 0.1meg/Fs
TEXT 96 -4560 Left 2 !.param L = 10u
TEXT 96 -4592 Left 2 !.param Fs = 200k
TEXT 96 -4464 Left 2 !.param D_min = 0.05
TEXT 96 -4432 Left 2 !.param D_max = 0.90
TEXT 96 -4496 Left 2 !.param SlopeAmp =0.2
TEXT 96 -4528 Left 2 !.param Ri = 0.25
TEXT 96 -4624 Left 2 !.param sync = 0
TEXT 192 -1664 Left 2 ;Drawn : Mark Dimattina
TEXT 184 -1752 Left 4 ;Title : PWM-CM3
TEXT 192 -1600 Left 2 ;Rev: 0.02
TEXT 192 -1632 Left 2 ;Date:10/06/2024
TEXT 192 -1568 Left 2 ;M.J.Dimattina@ieee.org
TEXT -1520 -2008 Left 2 !.param Cs = { 1 / ( L * (pi * Fs)**2 ) }
TEXT -800 -4088 Left 2 ;Peak Current
TEXT -1888 -3840 Left 2 ;V = L di/dt
TEXT -1888 -3808 Left 2 ;dt = L * di / V
TEXT 960 -2008 Left 2 ;delta I   during demag
TEXT -680 -2176 Left 2 ;di =V * dt /  L
TEXT -496 -2120 Left 2 ;delta I   during mag
TEXT -648 -1928 Left 2 ;Magentizing Current
TEXT -640 -1680 Left 2 ;De-magentizing Current
TEXT -1936 -3608 Left 2 ;On Time Duty Cycle
TEXT -1936 -3392 Left 2 ;Off Time Duty Cycle
TEXT -1768 -2928 Left 2 ;When Don + Doff > 1
TEXT -1264 -3704 Left 2 ;Don_1 = Don_0 / ( Don_0 + Doff_0 )
TEXT -1256 -3656 Left 2 ;simplifies to ->
TEXT -1888 -3752 Left 5 ;DCM
TEXT -1176 -3760 Left 5 ;CCM
TEXT -264 -3776 Left 5 ;Mode Toggle
TEXT -1344 -3072 Left 5 ;Mode Selection
TEXT -712 -2256 Left 5 ;Current Calculation
TEXT -1672 -2344 Left 5 ;Induced Inductor Voltage
TEXT -928 -4536 Left 5 ;Peak Current
TEXT -928 -2976 Left 2 ;Hysteresis to improve transient simulation speed
TEXT -1736 -4528 Left 5 ;Inductor Voltage
TEXT -1736 -4584 Left 5 ;Mag / Demag
TEXT -1520 -1968 Left 2 !.param Rs_CCM = { sqrt( L / Cs ) / Q }
TEXT -1720 -1968 Left 2 !.param Q = 10
TEXT -1520 -1928 Left 2 !.param Rs_DCM = { sqrt( L / Cs ) / 0.5 }
RECTANGLE Normal 640 -1472 -2016 -4704 2

The netlist it stands for:
* BuckBoost_negOutput_AC.asc
V1 Rload 0 PULSE({R_idle} {R_step} 2m 1u 1u 7m 16m)
R2 0 CM3-c 1m
Cout1 N002 CM3-out 220µ
R3 0 CM3-out R = V(Rload)
R4 0 N003 {Rdiv1}
R5 N003 CM3-out {Rdiv2}
V2 CM3-a 0 {Vin}
R8 0 N002 {Cesr}
R9 N001 CM3-out 1µ
XX2 CM3-Vi CM3-Vc transconerroramp params: C_comp2 = {C_comp2}, C_comp = {C_comp}, R_comp = {R_comp}, Pos = 3, Neg = 0, Gain = {TA_Gain}, Vref = {Vref}
V6 CM3-Vi CM3-Vo SINE(0) AC {AC_amp} 0
C2 0 0 100n
E3 CM3-Vo 0 N003 CM3-out 1
Cin1 CM3-a CM3-out 220µ
XX1 CM3-Vc CM3-a CM3-c N001 buck_cm3 params: sync = 0, L = {L}, Fs = {Fs}, Ri = {Ri} , SlopeAmp = {Se / Fs}, D_min = {clampL}, D_max = {clampH}

* block symbol definitions
.subckt transconerroramp Vi Vc
G1 0 Vc ref_Av N002 { Gain }
V1 ref_Av 0 {Vref}
C1 Vc 0 {C_comp2}
C2 N003 0 {C_comp}
R1 Vc N003 {R_comp}
B1 Vc 0 I= if( V(Vc)  > {Pos}, {alpha} * ( V(Vc) -  {Pos} ), 0 )
B2 0 Vc I= if( V(Vc)  < {Neg}, {alpha} * (  {Neg} - V(Vc)  ), 0 )
R2 Vc 0 1000Meg
C3 N002 0 1p
R3 N002 N001 10k
E1 N001 0 Vi_lim 0 1
B3 Vi_lim 0 V= limit(  V(Vi), {Neg}, {Pos}  )
R4 Vi 0 10Meg
.param alpha = 5m
.param R_comp =1k
.param C_comp = 1n
.param C_comp2 = 1p
* B1
* B2
* Drawn : Mark Dimattina
* Title : Transconductance Error Amp
* Rev: 0.04
* Date: 25/07/2017
* M.J.Dimattina@ieee.org
.param Pos = 4
.param Neg = 0
.param Vref = 2.5
.param Gain = 135u
.ends transconerroramp

.subckt buck_cm3 Vc A C P
Bin A C I=  V(I_mag)
Bout p C I=  V(I_demag)
XX1 Vc V_mag V_demag I_mag I_demag pwm_cm3 params: sync = {sync}, L = {L}, Fs = {Fs}, Ri = {Ri} , SlopeAmp = {SlopeAmp}, D_min = {D_min}, D_max = {D_max}
B1 V_mag 0 V= V(a, c)
B2 V_demag 0 V= V(c, p)
.param L = 10u
.param Fs = 200k
.param D_min = 0.05
.param D_max = 0.90
.param SlopeAmp =0.2
.param Ri = 0.25
.param sync = 0
* Drawn : Mark Dimattina
* Title : Buck-CM3
* Rev: 0.01
* Date: 22/05/2024
* M.J.Dimattina@ieee.org
* Buck
.ends buck_cm3

.subckt pwm_cm3 Vc V_mag V_demag I_mag I_demag
R3 Vc 0 1G
B6 I_Pk_min 0 V=  V(mag) * {D_min / (Fs * L ) }
B10 I_pk 0 V=  max( V(I_pk_raw), V(I_pk_min)  )
B26 I_pk_raw 0 V=  ( V(Vc) - {SlopeAmp} * V(don_2) ) / {Ri}
B21 Don_0 0 V = {Fs * L} * V(I_pk) / V(mag)
B11 Doff_0 0 V = {Fs * L} * V(I_pk) / (V(demag) + 1u)
B12 N005 0 V= if (  V(CCM_test)  > 1 , 1, 0  )
R7 CCM_raw N005 {100*R_lp}
C2 CCM_raw 0 10p
B14 Don_1 0 V= limit( V(demag) / ( V(mag) + V(demag)  ), {D_min}, {D_max} )
B15 Doff_1 0 V=  1- V(Don_1)
B16 N003 0 V= limit(  min( V(Don_1), V(Don_0)  ),  {D_min}, {D_max} )
R17 Don_2 N003 {1*R_lp}
C10 Don_2 0 10p
B18 N004 0 V = min (  V(Doff_1), V(Doff_0)  )
R18 Doff_2 N004 {1*R_lp}
C11 Doff_2 0 10p
B23 delta_I_demag 0 V= V(demag) * V(Doff_2) / {L * Fs}
B24 I_min_mag 0 V= V(I_pk) - V(delta_I_mag)
B25 delta_I_mag 0 V= V(mag) * V(Don_2) / {L * Fs}
B28 I_mag 0 V= ( V(I_min_mag) + V(delta_I_mag)/2  ) * V(Don_2)
B29 I_demag 0 V= ( V(I_pk) - V(delta_I_mag)/2  ) * V(Doff_2)
B30 I_min_demag 0 V= V(I_pk) - V(delta_I_mag)
Cs1 CCM_Ind_V P001 { Cs }
L1 CCM_Ind_V 0 {L} Rser=0.1u
B5 N001 0 V=  V(V_mag) - V(Ind_V)
R11 mag N001 {1 * R_lp}
C4 mag 0 10p
V1 N008 0 {Cs}
B4 Ind_V 0 V= limit( V(CCM_Ind_V), -1*V(V_demag) + 1m, (V(V_mag) - 1m) )
B20 N002 0 V=  V(V_demag) + V(Ind_V)
R13 demag N002 {R_lp}
C8 demag 0 10p
B7 CCM_test 0 V= limit( V(Don_0) + V(Doff_0), 0, 2)
B13 N006 0 V= if( sync > 0.5, 1, if( V(CCM_test) > 1,  V(tst1), V(tst2) )  )
B19 tst1 0 V= if( V(CCM_raw) > 0.9, 1, 0 )
B27 tst2 0 V= if( V(CCM_raw) < 0.1, 0, 1 )
R1 CCM N006 {10*R_lp}
C5 CCM 0 10p
B32 0 CCM_Ind_V I = V(I_min_mag)
Rs1 P001 0 R = V(Rs)
B1 N007 0 V= if( V(CCM) > 0.5, {Rs_CCM}, {Rs_DCM}  )
B2 N009 0 V= V(Rs)
R2 Rs N007 {100*R_lp}
C1 Rs 0 10p
.param R_lp = 0.1meg/Fs
.param L = 10u
.param Fs = 200k
.param D_min = 0.05
.param D_max = 0.90
.param SlopeAmp =0.2
.param Ri = 0.25
.param sync = 0
* Drawn : Mark Dimattina
* Title : PWM-CM3
* Rev: 0.02
* Date:10/06/2024
* M.J.Dimattina@ieee.org
.param Cs = { 1 / ( L * (pi * Fs)**2 ) }
* Peak Current
* V = L di/dt
* dt = L * di / V
* delta I   during demag
* di =V * dt /  L
* delta I   during mag
* Magentizing Current
* De-magentizing Current
* On Time Duty Cycle
* Off Time Duty Cycle
* When Don + Doff > 1
* Don_1 = Don_0 / ( Don_0 + Doff_0 )
* simplifies to ->
* DCM
* CCM
* Mode Toggle
* Mode Selection
* Current Calculation
* Induced Inductor Voltage
* Peak Current
* Hysteresis to improve transient simulation speed
* Inductor Voltage
* Mag / Demag
.param Rs_CCM = { sqrt( L / Cs ) / Q }
.param Q = 10
.param Rs_DCM = { sqrt( L / Cs ) / 0.5 }
.ends pwm_cm3

.param clampL = 0.1
.param clampH = 0.99
.ac oct 100 10 1meg
.param L = 37.5u
.param Fs = 50k
.param Ri = 0.33
.param Se = {rAmp * Fs}
* Compensation Ramp  - V/s
* R sense  - Ohms
* Switching Freq - Hz
* Inductance - H
* Duty Cycle Limits
* PWM-CM Parameters
.param Vref = 2.5
.param TA_Gain = 135u
.param C_comp = 4n
.param R_comp = 5k
.param I_idle = { abs( Vout / 3 ) }
.param I_step = { abs( Vout / 30 ) }
.param Vout = 5
.param R_idle = { Vout / I_idle}
.param R_step = { Vout / I_step }
.param Vin = 6
.param Rdiv2 = 10k
.param Rdiv1 = Rdiv2 * (Vout - Vref) / Vref
.param rAmp = 0.5m
* Error Amp Parameters
* Circuit Parameters
* Drawn : Mark Dimattina
* Title : BuckBoost_negOutput
* Rev: 0.01
* Date: 02/09/2017
* M.J.Dimattina@ieee.org
.step param Vout 5 7 2
.param  AC_amp = 0.01
* .param L = 37.5u
* .tran 0 12m 0
.param Cesr = 1m
.param C_comp2 = 1f
.backanno
.end

* Results of the author's LTspice run, read from the files saved beside the schematic
* Operating Point (first step), zero values left out:
*   vout = 5 
*   V(rload) = 3 V
*   V(cm3-c) = 3.056 mV
*   V(cm3-out) = -4.998 V
*   V(n003) = -2.499 V
*   V(cm3-a) = 6 V
*   V(n001) = -4.998 V
*   V(cm3-vc) = 1.249 V
*   V(cm3-vi) = 2.499 V
*   V(cm3-vo) = 2.499 V
*   I(R3) = 1.666 A
*   I(R9) = -1.666 A
*   I(R5) = 249.9 µA
*   I(R4) = 249.9 µA
*   I(R2) = -3.056 A
*   I(E3) = -249.9 nA
*   I(V6) = -249.9 nA
*   I(V2) = -1.39 A
*   Ix(x2:VI) = 249.9 nA
*   Ix(x2:VC) = -124.9 nA
*   Ix(x1:VC) = 124.9 nA
*   Ix(x1:A) = 1.39 A
*   Ix(x1:C) = -3.056 A
*   Ix(x1:P) = 1.666 A